# EAGLE design TPS61099x (EAGLE 9.0.0)
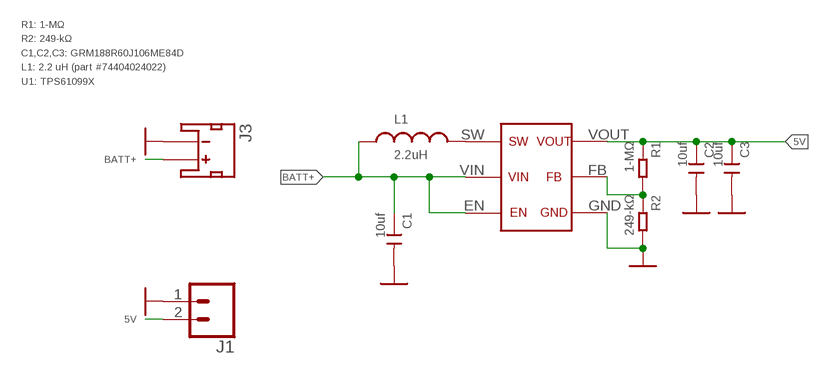
[diagram p0: schematic, sheet 1]

## Parts
C1  10uf  CERAMIC-22UF-6.3V-20%-X5R(0805)  [C0805]
C2  10uf  CERAMIC-22UF-6.3V-20%-X5R(0805)  [C0805]
C3  10uf  CERAMIC-22UF-6.3V-20%-X5R(0805)  [C0805]
J1  CONN_02PTH4  [1X02_XTRA_BIG]
J3  Batt Conn  JST_2MM_MALE  [JST-2-SMD]
L1  2.2uH  WE-LQS_2512_74404024022  [WE-LQS_2512]
R1  1-MΩ  SMD-RES-0.1R-5%-1/8W(0805)  [R0805]
R2  249-kΩ  SMD-RES-0.1R-5%-1/8W(0805)  [R0805]
U$1  TPS61099X  [TPS61099X]

## Nets
5V: C2.1 C3.1 J1.2 R1.1 U$1.VOUT
BATT+: C1.1 J3.2(+) L1.1 U$1.EN U$1.VIN
GND: C1.2 C2.2 C3.2 J1.1 J3.1(-) R2.2 U$1.GND
N$1: L1.2 U$1.SW
N$4: R1.2 R2.1 U$1.FB
Unconnected: J3.NC1(PAD1) J3.NC2(PAD2)

## Notes on the sheet
- R1: 1-MΩ
  R2: 249-kΩ
  C1,C2,C3: GRM188R60J106ME84D
  L1: 2.2 uH (part #74404024022)
  U1: TPS61099X

## Library data of the parts
C1-C3 = Seeed-Capacitor:CERAMIC-22UF-6.3V-20%-X5R(0805): 302010171; MPN: CC0805MKX5R5BB226; VALUE: 22uf
J1 = SparkFun-Connectors:CONN_02: Multi connection point. Often used as Generic Header-pin footprint for 0.1 inch spaced/style header connections On any of the 0.1 inch spaced packages, you can populate with these: Break Away Headers - Straight <https://www.sparkfun.com/products/116> (PRT-00116) Break Away Male Headers - Right Angle <https://www.sparkfun.com/products/553> (PRT-00553) Female Headers <https://www.sparkfun.com/products/115> (PRT-00115) Break Away Headers - Machine Pin <https://www.sparkfun.com/products/117> (PRT-00117) Break Away Female Headers - Swiss Machine Pin <https://www.sparkfun.com/products/743> (PRT-00743) For SCREWTERMINALS and SPRING TERMINALS visit here: Screw Terimnals on SparkFun.com <https://www.sparkfun.com/search/results?term=Screw+Terminals> (5mm/3.5mm/2.54mm spacing) This device is also useful as a general connection point to wire up your design to another part of your project. Our various solder wires solder well into these plated through hole pads. Hook-Up Wire - Assortment (Stranded, 22 AWG) <https://www.sparkfun.com/products/11375> (PRT-11375) Hook-Up Wire - Assortment (Solid Core, 22 AWG) <https://www.sparkfun.com/products/11367> (PRT-11367) View the entire wire category on our website here <https://www.sparkfun.com/categories/141> Special notes: Molex polarized connector foot print use with: PRT-08233 with associated crimp pins and housings. 2.54_SCREWTERM for use with PRT-10571. 3.5mm Screw Terminal footprints for PRT-08084 5mm Screw Terminal footprints for use with PRT-08432
J3 = SparkFun-Connectors:JST_2MM_MALE: Mates to single-cell LiPo batteries. CONN-11443 Now with smashable polarity marks!; BTM_NEG: -; BTM_POS: +; PROD_ID: CONN-11443; TOP_NEG: -; TOP_POS: +
L1 = PowerMagnetics (rev18e):WE-LQS_2512: SMD Shielded Tiny Power Inductor Characteristics Tiny Power Inductor design 1.7 times more current in comparison with unshielded versions Robust design & high durability Low RDC Magnetically shielded with magnetic glue reducing buzz noise in ultra-low levels Operating Temperature: –40 °C to +125 °C Applications Integrated DC/DC Converters Switching controllers which required high efficiency Portable power (Smartphones, digital cameras, Tablets, etc.) Embedded laptops and PCs Big sizes (5040, 60xx, 8040) used for shock-proof circuits <http://katalog.we-online.de/media/images/v2/Family_WE-LQS.jpg> Details see: http://katalog.we-online.de/en/pbs/WE-LQS Created by Dan Xu 2014-05-21 2014 (C) Wurth Elektronik; WE-NUMBER: 74404024022/2,2uH
R1 R2 = Seeed-Resistor:SMD-RES-0.1R-5%-1/8W(0805): 301010264; MPN: RL0805JR-070R1L; VALUE: 0.1R
U$1 = 32teeth - TPS61099x:TPS61099X

## Board
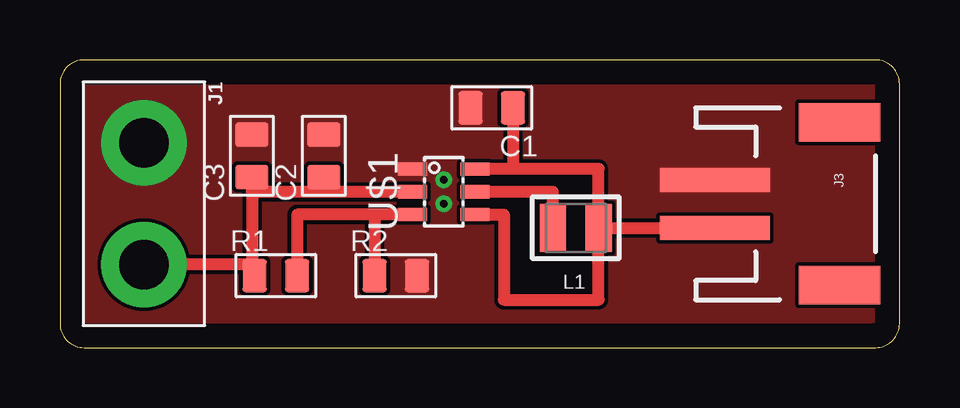
[diagram p1: board, top side]
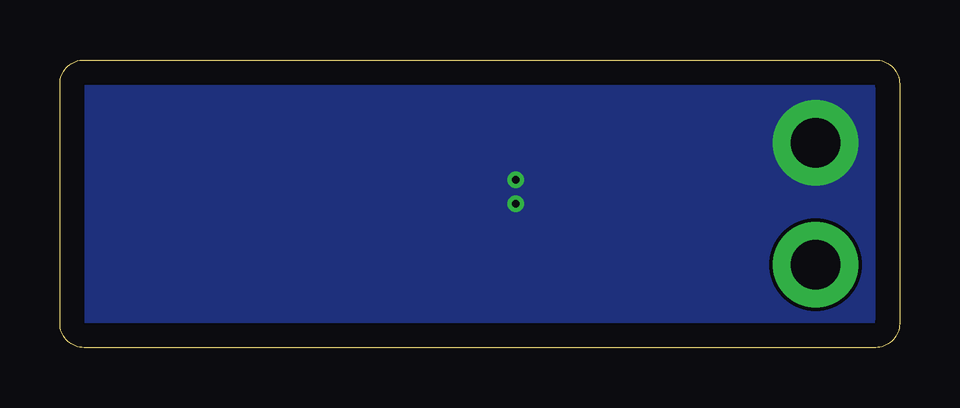
[diagram p2: board, bottom side, seen from below]

Size 35 x 12 mm. Coordinates in mm from the lower left corner, seen from the top.
Outline: 0,11 0,1 arc90 1,0 34,0 arc90 35,1 35,11 arc90 34,12 1,12 arc90 0,11
Copper layers (1*16): Top 0.035mm / dielectric 1.5mm / Bottom 0.035mm
Design rules "default": minimum track width 6mil, minimum drill 0.35mm, track to track 6mil, track to pad 6mil, pad to pad 6mil, via to via 6mil, smd to smd 6mil, copper to edge 40mil, drill to drill 6mil, minimum pad ring 10mil, minimum via ring 8mil, stop-mask expansion 4mil, vias tented up to drill 0mil, thermal gap 10mil

### Footprints (pad centres in the part's own frame; a part is rotated, then mirrored left to right if it is on the bottom)
C0805 = smd 1.397 x 1.016: 1 0,0.889; 2 0,-0.889
1X02_XTRA_BIG = drill 2.057 pad 3.556: 1 -2.54,0; 2 2.54,0
JST-2-SMD = smd 1 x 4.6: 1 -1,-3.7; 2 1,-3.7 | smd 1.6 x 3.4: NC1 -3.4,1.5; NC2 3.4,1.5
WE-LQS_2512 = smd 1.1 x 2: 1 -0.95,0; 2 0.95,0
R0805 = smd 1.397 x 1.016: 1 0,0.889; 2 0,-0.889
TPS61099X = smd 1.2 x 0.55: EN 1.3,-0.95; FB -1.3,-0.95; GND -1.3,0.95; SW 1.3,0; VIN 1.3,0.95; VOUT -1.3,0

### Placement (x,y rotation side)
C1  18,10 270 top
C2  11,8 180 top
C3  8,8 180 top
J1  3.5,6 270 top
J3  31,6 270 top
L1  21.5,5 180 top
R1  9,3 90 top
R2  14,3 90 top
U$1  16,6.5 0 top

### Tracks (layer width: path | path; a pad name or v marks a point on that pad's centre or on a via)
5V
  Top 0.508: U$1.VOUT 11,6.5 | 11,6.5 C2.1 11,6.5 | 11,6.5 8,6.5 C3.1 8,3 R1.1 8.11,3.46 J1.2
BATT+
  Top 0.508: C1.1 18.89,8 18.89,7.45 | 18.89,7.45 U$1.VIN | 22.45,6 L1.1 J3.2 | 22.45,6 22.45,7.45 18.89,7.45 | U$1.EN 18.5,5.55 18.5,2 22.45,2 22.45,6
GND  (via drill 0.3 pad 0.6)
  other vias: 16,7 16,6
  pour Top (no thermals): 0,12 35,12 35,0 0,0
  pour Bottom (no thermals): 0,12 35,12 35,0 0,0
N$1
  Top 0.508: L1.2 20.55,6.5 U$1.SW
N$4
  Top 0.508: R1.2 9.89,5.55 U$1.FB 13.11,5.55 R2.1